# EAGLE design LoL_Shield (EAGLE 5.06)
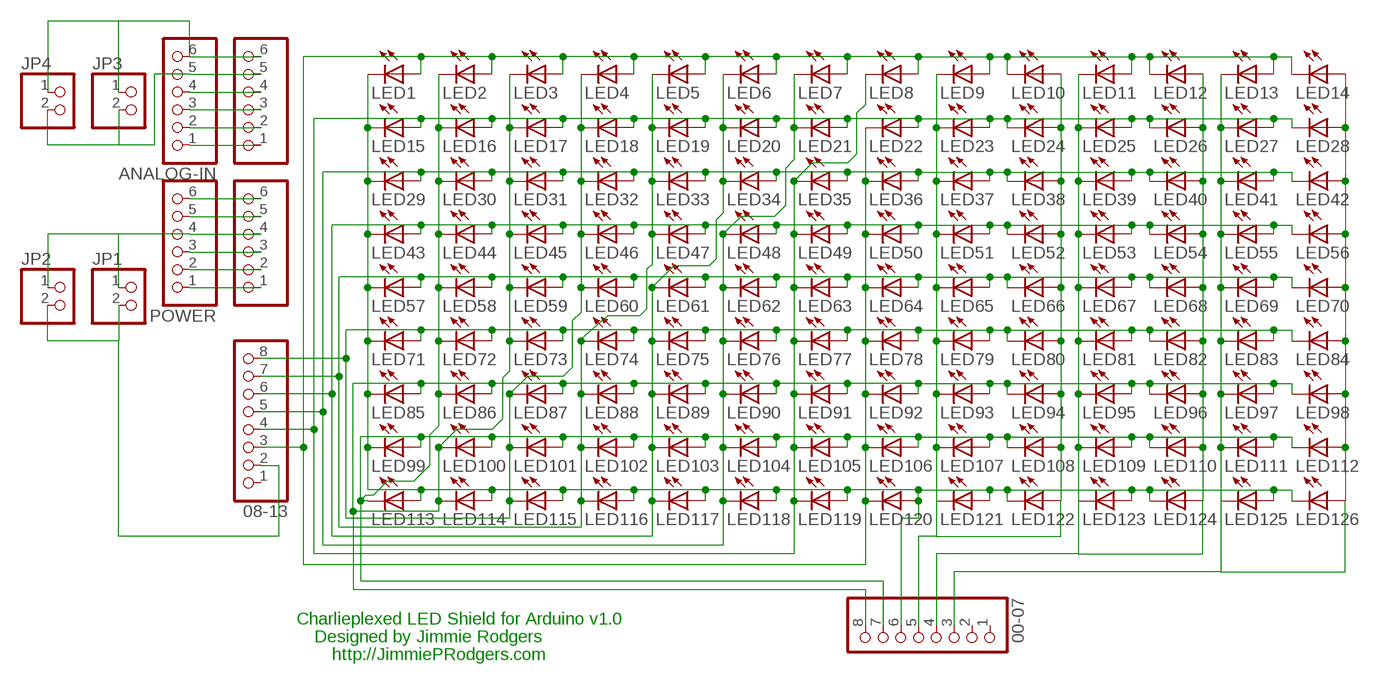
[diagram p0: schematic, sheet 1]

## Parts
00-07  PINHD-1X8CLEANBIG  [1X08-CLEANBIG]
08-13  PINHD-1X8CLEANBIG  [1X08-CLEANBIG]
ANALOG-IN  PINHD-1X6CB  [1X06-CLEANBIG]
ANALOG-IN1  PINHD-1X6CB  [1X06-CLEANBIG]
JP1  PINHD-1X2  [1X02]
JP2  PINHD-1X2  [1X02]
JP3  PINHD-1X2  [1X02]
JP4  PINHD-1X2  [1X02]
LED1  LED3MM  [LED3MM]
LED2  LED3MM  [LED3MM]
LED3  LED3MM  [LED3MM]
LED4  LED3MM  [LED3MM]
LED5  LED3MM  [LED3MM]
LED6  LED3MM  [LED3MM]
LED7  LED3MM  [LED3MM]
LED8  LED3MM  [LED3MM]
LED9  LED3MM  [LED3MM]
LED10  LED3MM  [LED3MM]
LED11  LED3MM  [LED3MM]
LED12  LED3MM  [LED3MM]
LED13  LED3MM  [LED3MM]
LED14  LED3MM  [LED3MM]
LED15  LED3MM  [LED3MM]
LED16  LED3MM  [LED3MM]
LED17  LED3MM  [LED3MM]
LED18  LED3MM  [LED3MM]
LED19  LED3MM  [LED3MM]
LED20  LED3MM  [LED3MM]
LED21  LED3MM  [LED3MM]
LED22  LED3MM  [LED3MM]
LED23  LED3MM  [LED3MM]
LED24  LED3MM  [LED3MM]
LED25  LED3MM  [LED3MM]
LED26  LED3MM  [LED3MM]
LED27  LED3MM  [LED3MM]
LED28  LED3MM  [LED3MM]
LED29  LED3MM  [LED3MM]
LED30  LED3MM  [LED3MM]
LED31  LED3MM  [LED3MM]
LED32  LED3MM  [LED3MM]
LED33  LED3MM  [LED3MM]
LED34  LED3MM  [LED3MM]
LED35  LED3MM  [LED3MM]
LED36  LED3MM  [LED3MM]
LED37  LED3MM  [LED3MM]
LED38  LED3MM  [LED3MM]
LED39  LED3MM  [LED3MM]
LED40  LED3MM  [LED3MM]
LED41  LED3MM  [LED3MM]
LED42  LED3MM  [LED3MM]
LED43  LED3MM  [LED3MM]
LED44  LED3MM  [LED3MM]
LED45  LED3MM  [LED3MM]
LED46  LED3MM  [LED3MM]
LED47  LED3MM  [LED3MM]
LED48  LED3MM  [LED3MM]
LED49  LED3MM  [LED3MM]
LED50  LED3MM  [LED3MM]
LED51  LED3MM  [LED3MM]
LED52  LED3MM  [LED3MM]
LED53  LED3MM  [LED3MM]
LED54  LED3MM  [LED3MM]
LED55  LED3MM  [LED3MM]
LED56  LED3MM  [LED3MM]
LED57  LED3MM  [LED3MM]
LED58  LED3MM  [LED3MM]
LED59  LED3MM  [LED3MM]
LED60  LED3MM  [LED3MM]
LED61  LED3MM  [LED3MM]
LED62  LED3MM  [LED3MM]
LED63  LED3MM  [LED3MM]
LED64  LED3MM  [LED3MM]
LED65  LED3MM  [LED3MM]
LED66  LED3MM  [LED3MM]
LED67  LED3MM  [LED3MM]
LED68  LED3MM  [LED3MM]
LED69  LED3MM  [LED3MM]
LED70  LED3MM  [LED3MM]
LED71  LED3MM  [LED3MM]
LED72  LED3MM  [LED3MM]
LED73  LED3MM  [LED3MM]
LED74  LED3MM  [LED3MM]
LED75  LED3MM  [LED3MM]
LED76  LED3MM  [LED3MM]
LED77  LED3MM  [LED3MM]
LED78  LED3MM  [LED3MM]
LED79  LED3MM  [LED3MM]
LED80  LED3MM  [LED3MM]
LED81  LED3MM  [LED3MM]
LED82  LED3MM  [LED3MM]
LED83  LED3MM  [LED3MM]
LED84  LED3MM  [LED3MM]
LED85  LED3MM  [LED3MM]
LED86  LED3MM  [LED3MM]
LED87  LED3MM  [LED3MM]
LED88  LED3MM  [LED3MM]
LED89  LED3MM  [LED3MM]
LED90  LED3MM  [LED3MM]
LED91  LED3MM  [LED3MM]
LED92  LED3MM  [LED3MM]
LED93  LED3MM  [LED3MM]
LED94  LED3MM  [LED3MM]
LED95  LED3MM  [LED3MM]
LED96  LED3MM  [LED3MM]
LED97  LED3MM  [LED3MM]
LED98  LED3MM  [LED3MM]
LED99  LED3MM  [LED3MM]
LED100  LED3MM  [LED3MM]
LED101  LED3MM  [LED3MM]
LED102  LED3MM  [LED3MM]
LED103  LED3MM  [LED3MM]
LED104  LED3MM  [LED3MM]
LED105  LED3MM  [LED3MM]
LED106  LED3MM  [LED3MM]
LED107  LED3MM  [LED3MM]
LED108  LED3MM  [LED3MM]
LED109  LED3MM  [LED3MM]
LED110  LED3MM  [LED3MM]
LED111  LED3MM  [LED3MM]
LED112  LED3MM  [LED3MM]
LED113  LED3MM  [LED3MM]
LED114  LED3MM  [LED3MM]
LED115  LED3MM  [LED3MM]
LED116  LED3MM  [LED3MM]
LED117  LED3MM  [LED3MM]
LED118  LED3MM  [LED3MM]
LED119  LED3MM  [LED3MM]
LED120  LED3MM  [LED3MM]
LED121  LED3MM  [LED3MM]
LED122  LED3MM  [LED3MM]
LED123  LED3MM  [LED3MM]
LED124  LED3MM  [LED3MM]
LED125  LED3MM  [LED3MM]
LED126  LED3MM  [LED3MM]
POWER  PINHD-1X6CB  [1X06-CLEANBIG]
POWER1  PINHD-1X6CB  [1X06-CLEANBIG]

## Nets
N$1: 08-13.2 JP1.2 JP2.2
N$2: ANALOG-IN1.5 ANALOG-IN.5 JP3.2 JP4.2
N$5: 00-07.5 LED9.K(C) LED10.A LED23.K(C) LED24.A LED37.K(C) LED38.A LED51.K(C) LED52.A LED65.K(C) LED66.A LED79.K(C) LED80.A LED93.K(C) LED94.A LED107.K(C) LED108.A LED121.K(C) LED122.A
N$11: ANALOG-IN1.6 ANALOG-IN.6 JP3.1 JP4.1
N$12: JP1.1 JP2.1 POWER1.4 POWER.4
N$39: ANALOG-IN1.4 ANALOG-IN.4
N$40: ANALOG-IN1.3 ANALOG-IN.3
N$41: ANALOG-IN1.2 ANALOG-IN.2
N$42: ANALOG-IN1.1 ANALOG-IN.1
N$43: POWER1.6 POWER.6
N$44: POWER1.5 POWER.5
N$46: POWER1.3 POWER.3
N$47: POWER1.2 POWER.2
N$48: POWER1.1 POWER.1
PIN2: 00-07.3 LED13.K(C) LED14.A LED27.K(C) LED28.A LED41.K(C) LED42.A LED55.K(C) LED56.A LED69.K(C) LED70.A LED83.K(C) LED84.A LED97.K(C) LED98.A LED111.K(C) LED112.A LED125.K(C) LED126.A
PIN3: 00-07.4 LED11.K(C) LED12.A LED25.K(C) LED26.A LED39.K(C) LED40.A LED53.K(C) LED54.A LED67.K(C) LED68.A LED81.K(C) LED82.A LED95.K(C) LED96.A LED109.K(C) LED110.A LED123.K(C) LED124.A
PIN5: 00-07.6 LED1.K(C) LED15.K(C) LED29.K(C) LED43.K(C) LED57.K(C) LED71.K(C) LED85.K(C) LED99.K(C) LED113.A LED114.A LED115.A LED116.A LED117.A LED118.A LED119.A LED120.A LED121.A LED122.K(C) LED123.A LED124.K(C) LED125.A LED126.K(C)
PIN6: 00-07.7 LED2.K(C) LED16.K(C) LED30.K(C) LED44.K(C) LED58.K(C) LED72.K(C) LED86.K(C) LED99.A LED100.A LED101.A LED102.A LED103.A LED104.A LED105.A LED106.A LED107.A LED108.K(C) LED109.A LED110.K(C) LED111.A LED112.K(C) LED113.K(C)
PIN7: 00-07.8 LED3.K(C) LED17.K(C) LED31.K(C) LED45.K(C) LED59.K(C) LED73.K(C) LED85.A LED86.A LED87.A LED88.A LED89.A LED90.A LED91.A LED92.A LED93.A LED94.K(C) LED95.A LED96.K(C) LED97.A LED98.K(C) LED100.K(C) LED114.K(C)
PIN8: 08-13.8 LED4.K(C) LED18.K(C) LED32.K(C) LED46.K(C) LED60.K(C) LED71.A LED72.A LED73.A LED74.A LED75.A LED76.A LED77.A LED78.A LED79.A LED80.K(C) LED81.A LED82.K(C) LED83.A LED84.K(C) LED87.K(C) LED101.K(C) LED115.K(C)
PIN9: 08-13.7 LED5.K(C) LED19.K(C) LED33.K(C) LED47.K(C) LED57.A LED58.A LED59.A LED60.A LED61.A LED62.A LED63.A LED64.A LED65.A LED66.K(C) LED67.A LED68.K(C) LED69.A LED70.K(C) LED74.K(C) LED88.K(C) LED102.K(C) LED116.K(C)
PIN10: 08-13.6 LED6.K(C) LED20.K(C) LED34.K(C) LED43.A LED44.A LED45.A LED46.A LED47.A LED48.A LED49.A LED50.A LED51.A LED52.K(C) LED53.A LED54.K(C) LED55.A LED56.K(C) LED61.K(C) LED75.K(C) LED89.K(C) LED103.K(C) LED117.K(C)
PIN11: 08-13.5 LED7.K(C) LED21.K(C) LED29.A LED30.A LED31.A LED32.A LED33.A LED34.A LED35.A LED36.A LED37.A LED38.K(C) LED39.A LED40.K(C) LED41.A LED42.K(C) LED48.K(C) LED62.K(C) LED76.K(C) LED90.K(C) LED104.K(C) LED118.K(C)
PIN12: 08-13.4 LED8.K(C) LED15.A LED16.A LED17.A LED18.A LED19.A LED20.A LED21.A LED22.A LED23.A LED24.K(C) LED25.A LED26.K(C) LED27.A LED28.K(C) LED35.K(C) LED49.K(C) LED63.K(C) LED77.K(C) LED91.K(C) LED105.K(C) LED119.K(C)
PIN13: 08-13.3 LED1.A LED2.A LED3.A LED4.A LED5.A LED6.A LED7.A LED8.A LED9.A LED10.K(C) LED11.A LED12.K(C) LED13.A LED14.K(C) LED22.K(C) LED36.K(C) LED50.K(C) LED64.K(C) LED78.K(C) LED92.K(C) LED106.K(C) LED120.K(C)
Unconnected: 00-07.1 00-07.2 08-13.1

## Notes on the sheet
- Charlieplexed LED Shield for Arduino v1.0
- Designed by Jimmie Rodgers
- http://JimmiePRodgers.com

## Library data of the parts
00-07 08-13 = carduino:PINHD-1X8: PIN HEADER
ANALOG-IN ANALOG-IN1 POWER POWER1 = carduino:PINHD-1X6: PIN HEADER
JP1 JP2 JP4 = pinhead:PINHD-1X2: PIN HEADER
JP3 = custom-jpr:PINHD-1X2: PIN HEADER
LED1-LED126 = led:LED: LED OSRAM: - CHIPLED LG R971, LG N971, LY N971, LG Q971, LY Q971, LO R971, LY R971 LH N974, LH R974 LS Q976, LO Q976, LY Q976 LO Q996 - Hyper CHIPLED LW Q18S LB Q993, LB Q99A, LB R99A - SideLED LS A670, LO A670, LY A670, LG A670, LP A670 LB A673, LV A673, LT A673, LW A673 LH A674 LY A675 LS A676, LA A676, LO A676, LY A676, LW A676 LS A679, LY A679, LG A679 - Hyper Micro SIDELED® LS Y876, LA Y876, LO Y876, LY Y876 LT Y87S - SmartLED LW L88C, LW L88S LB L89C, LB L89S, LG L890 LS L89K, LO L89K, LY L89K LS L896, LA L896, LO L896, LY L896 - TOPLED LS T670, LO T670, LY T670, LG T670, LP T670 LSG T670, LSP T670, LSY T670, LOP T670, LYG T670 LG T671, LOG T671, LSG T671 LB T673, LV T673, LT T673, LW T673 LH T674 LS T676, LA T676, LO T676, LY T676, LB T676, LH T676, LSB T676, LW T676 LB T67C, LV T67C, LT T67C, LS T67K, LO T67K, LY T67K, LW E67C LS E67B, LA E67B, LO E67B, LY E67B, LB E67C, LV E67C, LT E67C LW T67C LS T679, LY T679, LG T679 LS T770, LO T770, LY T770, LG T770, LP T770 LB T773, LV T773, LT T773, LW T773 LH T774 LS E675, LA E675, LY E675, LS T675 LS T776, LA T776, LO T776, LY T776, LB T776 LHGB T686 LT T68C, LB T68C - Hyper Mini TOPLED® LB M676 - Mini TOPLED Santana® LG M470 LS M47K, LO M47K, LY M47K Source: http://www.osram.convergy.de LUXEON: - LUMILED® LXK2-PW12-R00, LXK2-PW12-S00, LXK2-PW14-U00, LXK2-PW14-V00 LXK2-PM12-R00, LXK2-PM12-S00, LXK2-PM14-U00 LXK2-PE12-Q00, LXK2-PE12-R00, LXK2-PE12-S00, LXK2-PE14-T00, LXK2-PE14-U00 LXK2-PB12-K00, LXK2-PB12-L00, LXK2-PB12-M00, LXK2-PB14-N00, LXK2-PB14-P00, LXK2-PB14-Q00 LXK2-PR12-L00, LXK2-PR12-M00, LXK2-PR14-Q00, LXK2-PR14-R00 LXK2-PD12-Q00, LXK2-PD12-R00, LXK2-PD12-S00 LXK2-PH12-R00, LXK2-PH12-S00 LXK2-PL12-P00, LXK2-PL12-Q00, LXK2-PL12-R00 Source: www.luxeon.com KINGBRIGHT: KA-3528ASYC Source: www.kingbright.com

## Board
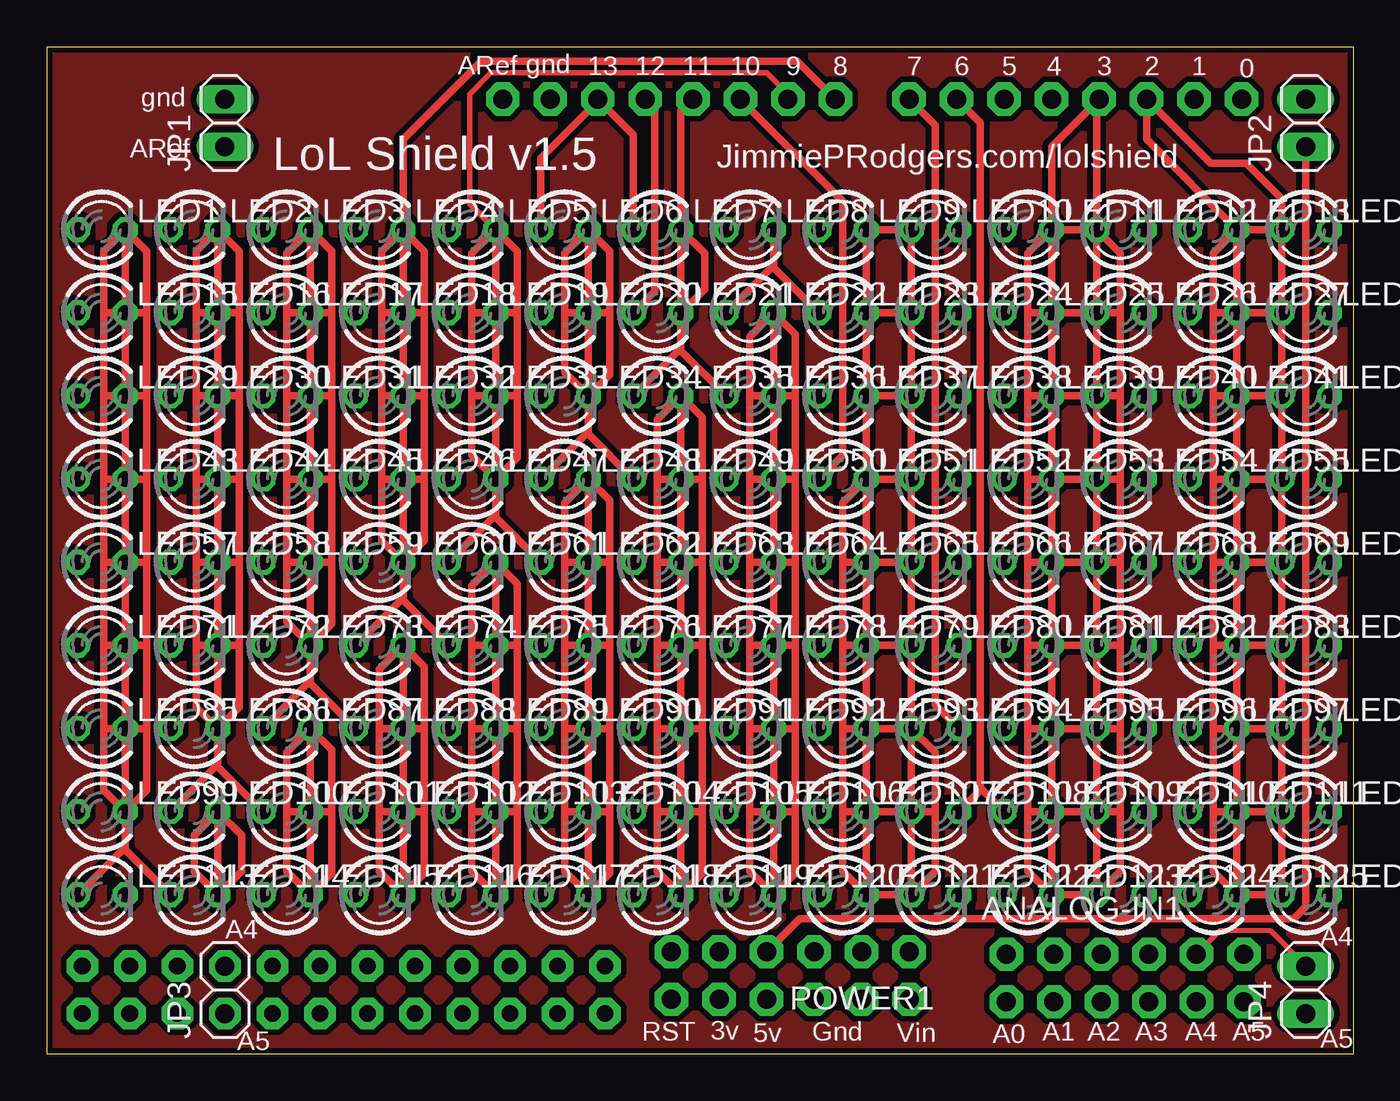
[diagram p1: board, top side]
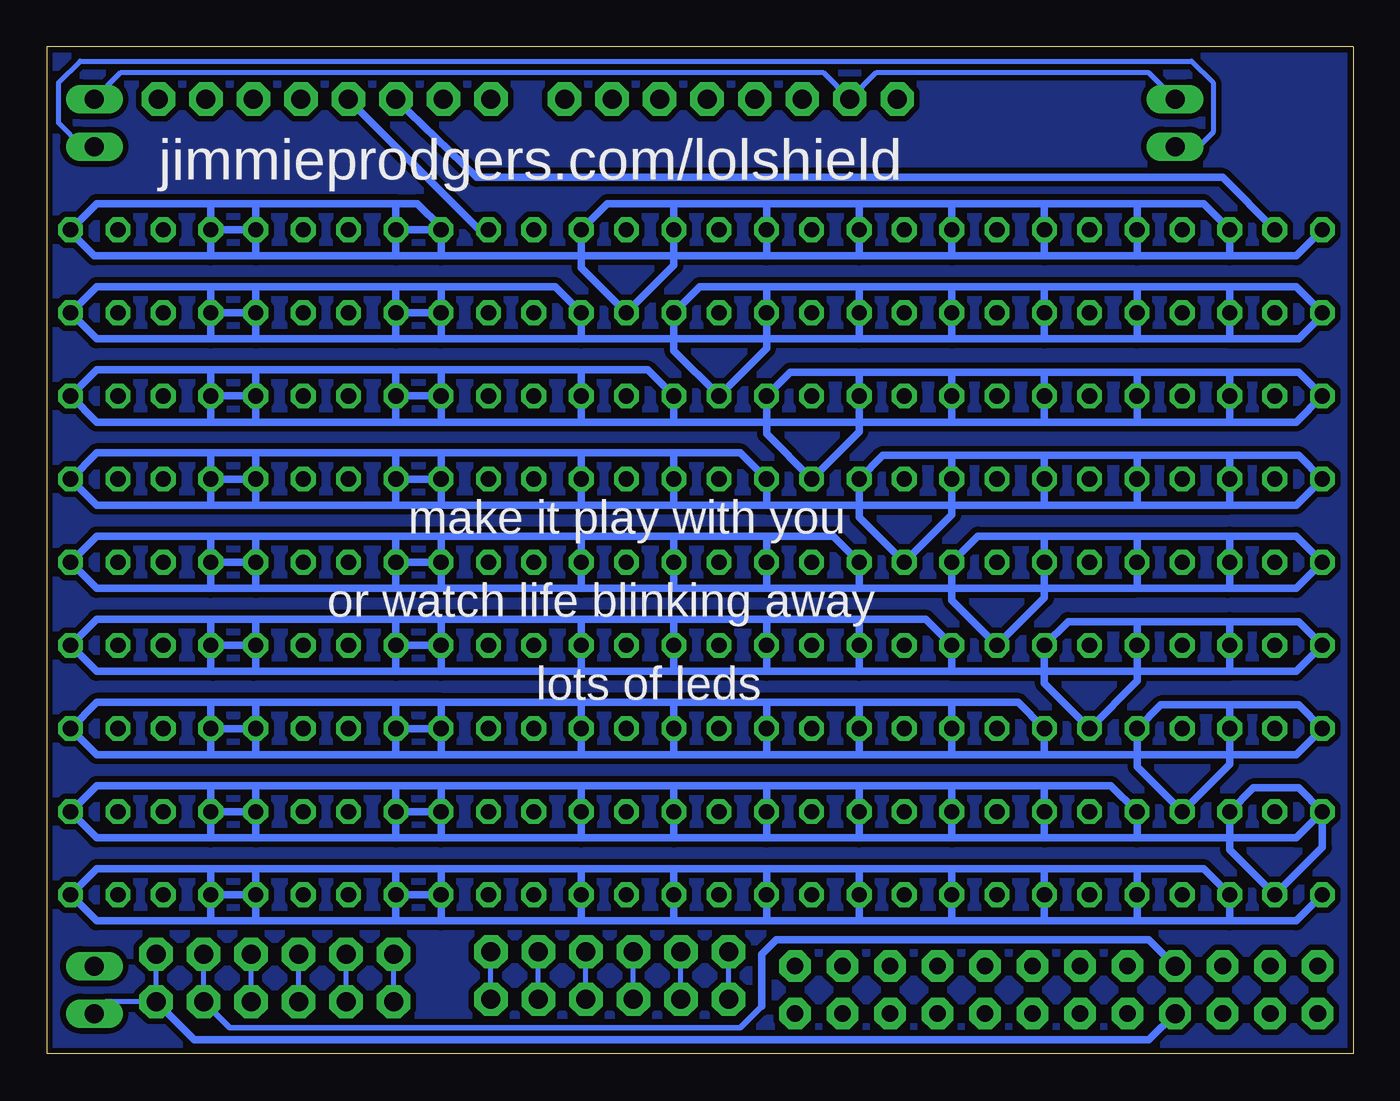
[diagram p2: board, bottom side, seen from below]

Size 69.85 x 53.85 mm. Coordinates in mm from the lower left corner, seen from the top.
Outline: 0,0 69.85,0 69.85,53.85 0,53.85 0,0
Copper layers (1*16): Top 0.035mm / dielectric 1.5mm / Bottom 0.035mm
Design rules "default": minimum track width 10mil, minimum drill 19mil, track to track 10mil, track to pad 10mil, pad to pad 0mil, via to via 10mil, smd to smd 0mil, copper to edge 10mil, drill to drill 8mil, minimum pad ring 10mil, minimum via ring 8mil, stop-mask expansion 4mil, vias tented up to drill 0mil, thermal gap 10mil

### Footprints (pad centres in the part's own frame; a part is rotated, then mirrored left to right if it is on the bottom)
1X08-CLEANBIG = drill 1.016 pad 1.778 octagon: 1 -8.89,0; 2 -6.35,0; 3 -3.81,0; 4 -1.27,0; 5 1.27,0; 6 3.81,0; 7 6.35,0; 8 8.89,0
1X06-CLEANBIG = drill 1.016 pad 1.778 octagon: 1 -6.35,0; 2 -3.81,0; 3 -1.27,0; 4 1.27,0; 5 3.81,0; 6 6.35,0
1X02 = drill 1.016 long: 1 -1.27,0; 2 1.27,0
1X02' = drill 1.016 pad 1.676 octagon: 1 -1.27,0; 2 1.27,0
LED3MM = drill 0.813 octagon: A -1.27,0; K 1.27,0

### Placement (x,y rotation side)
00-07  54.99,51.05 180 top
08-13  33.27,51.05 0 top
ANALOG-IN  57.66,2.79 0 top
ANALOG-IN1  57.66,5.33 0 top
JP1  9.53,49.78 90 top
JP2  67.31,49.78 90 top
JP3  [1X02']  9.53,3.43 90 top
JP4  67.31,3.43 90 top
LED1  2.92,44.07 0 top
LED2  7.87,44.07 0 top
LED3  12.83,44.07 0 top
LED4  17.78,44.07 0 top
LED5  22.73,44.07 0 top
LED6  27.69,44.07 0 top
LED7  32.64,44.07 0 top
LED8  37.59,44.07 0 top
LED9  42.55,44.07 0 top
LED10  47.5,44.07 0 top
LED11  52.45,44.07 0 top
LED12  57.4,44.07 0 top
LED13  62.36,44.07 0 top
LED14  67.31,44.07 0 top
LED15  2.92,39.62 0 top
LED16  7.87,39.62 0 top
LED17  12.83,39.62 0 top
LED18  17.78,39.62 0 top
LED19  22.73,39.62 0 top
LED20  27.69,39.62 0 top
LED21  32.64,39.62 0 top
LED22  37.59,39.62 0 top
LED23  42.55,39.62 0 top
LED24  47.5,39.62 0 top
LED25  52.45,39.62 0 top
LED26  57.4,39.62 0 top
LED27  62.36,39.62 0 top
LED28  67.31,39.62 0 top
LED29  2.92,35.18 0 top
LED30  7.87,35.18 0 top
LED31  12.83,35.18 0 top
LED32  17.78,35.18 0 top
LED33  22.73,35.18 0 top
LED34  27.69,35.18 0 top
LED35  32.64,35.18 0 top
LED36  37.59,35.18 0 top
LED37  42.55,35.18 0 top
LED38  47.5,35.18 0 top
LED39  52.45,35.18 0 top
LED40  57.4,35.18 0 top
LED41  62.36,35.18 0 top
LED42  67.31,35.18 0 top
LED43  2.92,30.73 0 top
LED44  7.87,30.73 0 top
LED45  12.83,30.73 0 top
LED46  17.78,30.73 0 top
LED47  22.73,30.73 0 top
LED48  27.69,30.73 0 top
LED49  32.64,30.73 0 top
LED50  37.59,30.73 0 top
LED51  42.55,30.73 0 top
LED52  47.5,30.73 0 top
LED53  52.45,30.73 0 top
LED54  57.4,30.73 0 top
LED55  62.36,30.73 0 top
LED56  67.31,30.73 0 top
LED57  2.92,26.29 0 top
LED58  7.87,26.29 0 top
LED59  12.83,26.29 0 top
LED60  17.78,26.29 0 top
LED61  22.73,26.29 0 top
LED62  27.69,26.29 0 top
LED63  32.64,26.29 0 top
LED64  37.59,26.29 0 top
LED65  42.55,26.29 0 top
LED66  47.5,26.29 0 top
LED67  52.45,26.29 0 top
LED68  57.4,26.29 0 top
LED69  62.36,26.29 0 top
LED70  67.31,26.29 0 top
LED71  2.92,21.84 0 top
LED72  7.87,21.84 0 top
LED73  12.83,21.84 0 top
LED74  17.78,21.84 0 top
LED75  22.73,21.84 0 top
LED76  27.69,21.84 0 top
LED77  32.64,21.84 0 top
LED78  37.59,21.84 0 top
LED79  42.55,21.84 0 top
LED80  47.5,21.84 0 top
LED81  52.45,21.84 0 top
LED82  57.4,21.84 0 top
LED83  62.36,21.84 0 top
LED84  67.31,21.84 0 top
LED85  2.92,17.4 0 top
LED86  7.87,17.4 0 top
LED87  12.83,17.4 0 top
LED88  17.78,17.4 0 top
LED89  22.73,17.4 0 top
LED90  27.69,17.4 0 top
LED91  32.64,17.4 0 top
LED92  37.59,17.4 0 top
LED93  42.55,17.4 0 top
LED94  47.5,17.4 0 top
LED95  52.45,17.4 0 top
LED96  57.4,17.4 0 top
LED97  62.36,17.4 0 top
LED98  67.31,17.4 0 top
LED99  2.92,12.95 0 top
LED100  7.87,12.95 0 top
LED101  12.83,12.95 0 top
LED102  17.78,12.95 0 top
LED103  22.73,12.95 0 top
LED104  27.69,12.95 0 top
LED105  32.64,12.95 0 top
LED106  37.59,12.95 0 top
LED107  42.55,12.95 0 top
LED108  47.5,12.95 0 top
LED109  52.45,12.95 0 top
LED110  57.4,12.95 0 top
LED111  62.36,12.95 0 top
LED112  67.31,12.95 0 top
LED113  2.92,8.51 0 top
LED114  7.87,8.51 0 top
LED115  12.83,8.51 0 top
LED116  17.78,8.51 0 top
LED117  22.73,8.51 0 top
LED118  27.69,8.51 0 top
LED119  32.64,8.51 0 top
LED120  37.59,8.51 0 top
LED121  42.55,8.51 0 top
LED122  47.5,8.51 0 top
LED123  52.45,8.51 0 top
LED124  57.4,8.51 0 top
LED125  62.36,8.51 0 top
LED126  67.31,8.51 0 top
POWER  39.75,2.92 180 top
POWER1  39.75,5.46 180 top

### Tracks (layer width: path | path; a pad name or v marks a point on that pad's centre or on a via)
BOTTOMFILL
  pour Bottom (isolate 0.305): 0,53.85 69.85,53.85 69.85,0 0,0
N$1
  Bottom 0.254: JP1.2 10.92,52.45 25.53,52.45 08-13.2 28.32,52.45 65.91,52.45 JP2.2
N$2
  Top 0.254: ANALOG-IN1.5 62.74,6.6 65.41,6.6 JP4.2
  Bottom 0.254: ANALOG-IN.5 ANALOG-IN1.5
  Bottom 0.305: ANALOG-IN.5 60.07,1.4 32.77,1.4 31.62,2.54
  Bottom 0.406: JP3.2 10.92,6.1 30.86,6.1 31.62,5.33 31.62,2.54
N$3  (via drill 0.9 pad 1.68)
  other vias: 6.99,4.7
N$5
  Top 0.406: 43.94,8.38 42.55,9.78 42.55,12.95 | LED107.K LED121.K LED122.A | LED107.K LED93.K | LED93.K LED79.K | LED65.K LED79.K | LED65.K LED51.K | LED51.K LED37.K | LED37.K LED23.K | LED23.K LED9.K LED10.A LED24.A | LED107.K LED108.A | LED93.K LED94.A | LED79.K LED80.A | LED65.K LED66.A | LED51.K LED52.A | LED37.K LED38.A | LED23.K LED24.A | LED38.A LED24.A | LED52.A LED38.A | LED94.A LED80.A | LED66.A LED80.A | LED66.A LED52.A | LED108.A LED122.A | LED108.A LED94.A | LED122.A 47.5,9.78 47.5,12.95 | 47.5,12.95 47.5,16.13 LED94.A | LED108.A 47.5,12.95 | 42.55,12.95 42.55,26.29 | 42.55,26.29 42.55,29.46 LED51.K | 42.55,26.29 LED65.K | LED79.K 42.67,21.84 | LED93.K 42.67,17.4 | 42.55,12.95 LED107.K
  Bottom 0.406: LED10.A 46.74,44.07 00-07.5
N$7  (via drill 0.9 pad 1.68)
  other vias: 12.06,4.7
N$8  (via drill 0.9 pad 1.68)
  other vias: 14.61,4.7
N$9  (via drill 0.9 pad 1.68)
  other vias: 17.14,4.7
N$10  (via drill 0.9 pad 1.68)
  other vias: 19.68,4.7
N$11
  Bottom 0.254: ANALOG-IN1.6 ANALOG-IN.6 66.67,2.79 JP4.1
  Bottom 0.406: JP3.1 10.92,0.76 61.98,0.76 ANALOG-IN.6
N$12
  Top 0.406: POWER1.4 40.26,7.24 66.67,7.24 67.31,7.87 JP2.1
  Bottom 0.254: POWER.4 POWER1.4 | JP1.1 8.26,48.51 7.49,49.28 7.49,51.94 8.64,53.09 68.07,53.09 69.22,51.94 69.22,49.78 67.94,48.51 JP2.1
N$13  (via drill 0.9 pad 1.68)
  other vias: 6.99,2.16
N$15  (via drill 0.9 pad 1.68)
  other vias: 12.06,2.16
N$18  (via drill 0.9 pad 1.68)
  other vias: 14.61,2.16
N$27  (via drill 0.9 pad 1.68)
  other vias: 17.14,2.16
N$28  (via drill 0.9 pad 1.68)
  other vias: 19.68,2.16
N$29  (via drill 0.9 pad 1.68)
  other vias: 22.23,4.7
N$30  (via drill 0.9 pad 1.68)
  other vias: 22.23,2.16
N$31  (via drill 0.9 pad 1.68)
  other vias: 24.77,4.7
N$32  (via drill 0.9 pad 1.68)
  other vias: 24.77,2.16
N$33  (via drill 0.9 pad 1.68)
  other vias: 29.84,4.7
N$34  (via drill 0.9 pad 1.68)
  other vias: 27.3,2.16
N$35  (via drill 0.9 pad 1.68)
  other vias: 29.84,2.16
N$36  (via drill 0.9 pad 1.68)
  other vias: 27.3,4.7
N$37  (via drill 0.9 pad 1.68)
  other vias: 1.91,4.7
N$38  (via drill 0.9 pad 1.68)
  other vias: 1.91,2.16
N$39
  Bottom 0.254: ANALOG-IN.4 ANALOG-IN1.4
N$40
  Bottom 0.254: ANALOG-IN.3 ANALOG-IN1.3
N$41
  Bottom 0.254: ANALOG-IN.2 ANALOG-IN1.2
N$42
  Bottom 0.254: ANALOG-IN.1 ANALOG-IN1.1
N$43
  Bottom 0.254: POWER.6 POWER1.6
N$44
  Bottom 0.254: POWER.5 POWER1.5
N$45  (via drill 0.9 pad 1.68)
  other vias: 4.45,4.7
N$46
  Bottom 0.254: POWER.3 POWER1.3
N$47
  Bottom 0.254: POWER.2 POWER1.2
N$48
  Bottom 0.254: POWER.1 POWER1.1
N$49  (via drill 0.9 pad 1.68)
  other vias: 4.45,2.16
PIN2
  Top 0.406: LED28.A LED14.A | LED125.K LED126.A | LED111.K LED112.A 66.04,13.08 | LED97.K LED98.A | LED83.K LED84.A | LED69.K LED70.A | LED55.K LED56.A | LED41.K LED42.A | LED27.K LED28.A | LED125.K LED126.A | LED125.K LED111.K | LED111.K LED97.K | LED97.K LED83.K | LED83.K LED69.K | LED69.K LED55.K | LED55.K LED41.K | LED41.K LED27.K | LED42.A LED28.A | LED56.A LED42.A | LED70.A LED56.A | LED84.A LED70.A | LED98.A LED84.A | 66.04,13.08 LED98.A | LED126.A 66.04,13.08 | LED13.K 58.8,48.89 00-07.3 62.23,47.62 64.14,47.62 66.04,45.72 LED14.A | LED13.K LED14.A | LED27.K LED13.K | LED13.K 62.36,42.8 62.36,39.62 | 62.36,35.18 62.36,39.62 | 62.36,30.73 62.36,35.18 | 62.36,26.29 62.36,30.73 | 62.36,21.84 62.36,26.29 | 62.36,17.4 62.36,21.84 | 62.36,12.95 62.36,17.4 | 62.36,12.95 62.36,9.78 LED125.K | 62.36,39.62 LED27.K | 62.36,35.18 LED41.K | 62.36,30.73 LED55.K | 62.36,26.29 LED69.K | 62.36,21.84 LED83.K | 62.36,17.4 LED97.K | 62.36,12.95 LED111.K
PIN3
  Top 0.406: LED123.K LED109.K | LED109.K LED95.K | LED95.K LED81.K | LED81.K LED67.K | LED67.K LED53.K | LED39.K LED53.K | LED39.K LED25.K | LED25.K LED11.K | LED11.K LED12.A | LED25.K LED26.A | LED39.K LED40.A | LED53.K LED54.A | LED67.K LED68.A | LED81.K LED82.A | LED95.K LED96.A | LED109.K LED110.A | LED123.K LED124.A | LED124.A LED110.A | LED110.A LED96.A | LED96.A LED82.A | LED82.A LED68.A | LED68.A LED54.A | LED40.A LED54.A | LED40.A LED26.A | LED26.A LED12.A | LED12.A 56.13,50.93 00-07.4 53.72,48.51 LED11.K | LED12.A 57.4,42.8 57.4,39.62 | 57.4,35.18 57.4,39.62 | 57.4,26.29 57.4,35.18 | 57.4,12.95 57.4,26.29 | 57.4,12.95 57.4,9.78 LED124.A | LED123.K 52.45,9.78 52.45,12.95 | 52.45,12.95 52.45,17.4 | 52.45,17.4 52.45,21.84 | 52.45,21.84 52.45,35.18 | 52.45,35.18 52.45,39.62 | 52.45,39.62 52.45,42.8 LED11.K | 52.45,39.62 LED25.K | 57.4,39.62 LED26.A | LED40.A 57.4,35.18 | 52.45,35.18 LED39.K | LED54.A 57.28,30.73 | LED53.K 52.58,30.73 | LED67.K 52.58,26.29 | 57.4,26.29 LED68.A | LED82.A 57.28,21.84 | 52.45,21.84 LED81.K | 52.45,17.4 LED95.K | LED96.A 57.28,17.4 | 52.45,12.95 LED109.K | LED110.A 57.4,12.95
PIN5
  Top 0.406: LED1.K 3.05,42.93 3.05,39.37 | 3.05,17.27 3.05,14.1 LED99.K | 3.05,17.27 3.05,21.84 | 3.05,21.84 3.05,26.29 | 3.05,26.29 3.05,30.61 | 3.05,35.18 3.05,30.61 | 3.05,39.37 3.05,35.18 | LED1.K 5.33,42.93 5.33,35.18 | 5.33,35.18 5.33,30.73 | 5.33,30.73 5.33,26.29 | 5.33,21.84 5.33,26.29 | 5.33,17.4 5.33,21.84 | 3.05,17.27 3.05,17.4 LED85.K 5.33,17.4 | 3.05,21.84 LED71.K 5.33,21.84 | 3.05,26.29 LED57.K 5.33,26.29 | 3.05,30.61 3.05,30.73 LED43.K 5.33,30.73 | 3.05,35.18 3.05,35.31 | 3.05,39.37 3.05,39.62 LED15.K 5.33,39.62 | 3.05,35.18 LED29.K 5.33,35.18 | LED114.A 4.19,10.92 LED99.K | 5.33,17.4 5.33,14.1 LED99.K | LED99.K LED1.K | LED113.A 4.06,10.92
  Bottom 0.406: 6.6,7.11 3.05,7.11 LED113.A | 6.6,7.11 11.56,7.11 | 11.56,7.11 16.51,7.11 | 16.51,7.11 21.46,7.11 | 21.46,7.11 26.42,7.11 | 26.42,7.11 31.24,7.11 | 31.24,7.11 36.32,7.11 | 36.32,7.11 41.27,7.11 | 41.27,7.11 48.77,7.11 | 48.77,7.11 51.18,7.11 | 51.18,7.11 58.67,7.11 | 58.67,7.11 61.09,7.11 | 61.09,7.11 67.18,7.11 LED126.K 67.18,9.91 61.09,9.91 | 51.18,9.91 58.67,9.91 | 58.67,9.91 61.09,9.91 | 26.42,9.91 31.37,9.91 | 31.37,9.91 36.32,9.91 | 36.32,9.91 41.27,9.91 | 41.27,9.91 48.77,9.91 | 48.77,9.91 51.18,9.91 | 21.46,9.91 26.42,9.91 | 11.56,9.91 8,9.91 LED114.A 6.6,7.11 | 11.56,9.91 16.51,9.91 | 16.51,9.91 21.46,9.91 | 41.27,7.11 LED121.A 41.27,9.91 | LED122.K LED123.A | 48.77,7.11 LED122.K | 58.67,7.11 LED124.K | LED124.K LED125.A | 11.56,7.11 LED115.A 11.56,9.91 | 16.51,7.11 LED116.A 16.51,9.91 | 21.46,7.11 LED117.A 21.46,9.91 | 26.42,7.11 LED118.A 26.42,9.91 | 31.24,7.11 31.37,7.24 LED119.A 31.37,9.91 | 36.32,7.11 LED120.A 36.32,9.91 | LED122.K 48.77,9.91 | 51.18,7.11 51.18,9.91 | 58.67,9.91 LED124.K | 61.09,7.11 61.09,9.91 | 00-07.6 46.86,46.86 6.99,46.86 LED1.K
PIN6
  Top 0.406: LED2.K 8,42.93 8,39.75 | 8,21.72 8,18.54 LED86.K | 8,21.72 8,26.29 | 8,26.29 8,30.73 | 8,35.18 8,30.73 | 8,39.75 8,35.18 | 8,39.75 8,39.62 LED16.K 10.29,39.62 | 8,35.18 LED30.K 10.29,35.18 | 8,30.73 LED44.K 10.29,30.73 | 8,26.29 LED58.K 10.29,26.29 | 8,21.72 8,21.84 LED72.K 10.29,21.84 | LED86.K 10.29,18.54 10.29,21.84 | 10.29,21.84 10.29,26.29 | 10.29,26.29 10.29,30.73 | 10.29,35.18 10.29,30.73 | 10.29,39.62 10.29,35.18 | 10.29,39.62 10.29,42.93 LED2.K | LED86.K LED2.K | 9.14,15.49 9.14,15.37 LED101.A | 9.14,15.49 LED86.K | LED100.A 9.14,15.49 | 00-07.7 49.91,49.78 49.91,15.24 | 49.91,15.24 49.91,14.1 LED108.K | 49.91,15.24 49.91,14.22 LED109.A
  Bottom 0.406: 11.56,11.56 3.05,11.56 LED99.A | 11.56,11.56 16.51,11.56 | 16.51,11.56 21.46,11.56 | 21.46,11.56 26.42,11.56 | 26.42,11.56 31.37,11.56 | 31.37,11.56 36.32,11.56 | 36.32,11.56 41.27,11.56 | 41.27,11.56 48.77,11.56 | 48.77,11.56 51.18,11.56 | 51.18,11.56 58.67,11.56 | 58.67,11.56 61.09,11.56 | 61.09,11.56 67.18,11.56 LED112.K 67.18,14.35 61.09,14.35 | LED100.A 5.33,14.22 2.92,14.22 LED99.A | LED99.A 1.65,11.05 LED113.K 6.6,10.92 6.6,12.83 | 16.51,14.35 12.95,14.35 LED101.A 11.56,11.56 | 16.51,14.35 21.46,14.35 | 21.46,14.35 26.42,14.35 | 26.42,14.35 31.37,14.35 | 31.37,14.35 36.32,14.35 | 36.32,14.35 41.27,14.35 | 41.27,14.35 48.77,14.35 | 48.77,14.35 51.18,14.35 | 58.67,14.35 LED110.K | 51.18,11.56 LED109.A | LED109.A LED108.K | 41.27,11.56 LED107.A 41.27,14.35 | 36.32,11.56 LED106.A 36.32,14.35 | 31.37,11.56 LED105.A 31.37,14.35 | 26.42,11.56 LED104.A 26.42,14.35 | 21.46,11.56 LED103.A 21.46,14.35 | 16.51,11.56 LED102.A 16.51,14.35 | 48.77,11.56 48.77,14.35 | 51.18,14.35 LED109.A | 51.18,14.35 58.67,14.35 | 58.67,14.35 61.09,14.35 | 58.67,11.56 58.67,12.83 | 61.09,11.56 LED111.A | 61.09,14.35 LED111.A | LED110.K LED111.A | LED110.K 58.55,12.95
PIN7
  Top 0.406: LED3.K 12.83,42.8 12.83,39.62 | 12.83,26.29 12.83,23.11 LED73.K | 12.83,26.29 12.83,30.61 | 12.83,30.61 12.83,35.18 | 12.83,35.18 12.83,39.62 | LED17.K 12.83,39.62 | LED31.K 12.83,35.18 | LED45.K 12.95,30.73 12.83,30.61 | 12.83,26.29 13.97,26.29 | 13.97,26.29 LED59.K | LED73.K 14.1,19.81 LED88.A | LED73.K 14.1,19.94 LED87.A | LED73.K 15.24,22.99 15.24,35.18 | 15.24,35.18 15.24,39.62 | 15.24,39.62 15.24,42.93 LED3.K | LED17.K LED3.K | LED31.K LED17.K | LED31.K LED45.K | LED45.K 14.1,21.97 | 13.97,26.29 15.11,26.29 | LED45.K 15.11,30.73 | 15.24,35.18 LED31.K | 15.24,39.62 LED17.K | LED114.K 7.87,9.78 7.87,11.68 LED100.K | LED100.K 10.41,11.68 10.41,9.78 LED114.K | 00-07.8 47.5,49.66 47.5,18.67 LED94.K | LED100.K LED114.K
  Bottom 0.406: 16.51,16 3.05,16 LED85.A 2.92,18.67 10.29,18.67 LED87.A 11.56,15.37 LED100.K 6.6,15.49 LED86.A 6.6,18.54 | 16.51,16 21.46,16 | 21.46,16 26.29,16 | 26.29,16 31.37,16 | 31.37,16 36.32,16 | 36.32,16 41.4,16 | 41.4,16 48.77,16 | 48.77,16 51.31,16 | 51.31,16 58.67,16 | 58.67,16 61.21,16 | 61.21,16 67.18,16 LED98.K 67.18,18.8 61.09,18.8 | 21.46,18.8 17.91,18.8 LED88.A 16.51,16 | 21.46,18.8 26.42,18.8 | 26.42,18.8 31.37,18.8 | 31.37,18.8 36.32,18.8 | 36.32,18.8 41.27,18.8 | 48.77,18.8 41.27,18.8 | 48.77,18.8 51.18,18.8 | 51.18,18.8 58.67,18.8 | 58.67,18.8 61.09,18.8 | LED95.A LED94.K | LED95.A 51.18,16.13 51.31,16 | LED97.A LED96.K | LED97.A 61.09,16.13 61.21,16 | 21.46,16 LED89.A 21.46,18.8 | 26.29,16 26.42,16.13 LED90.A 26.42,18.8 | 31.37,16 LED91.A 31.37,18.8 | 36.32,16 LED92.A 36.32,18.8 | 41.27,17.27 41.27,16.13 41.4,16 | 41.27,17.27 LED93.A | 41.27,17.27 41.27,18.8 | 48.77,16 48.77,18.8 | 51.18,18.8 LED95.A | 58.67,16 58.67,18.8 | 61.09,18.8 LED97.A
PIN8
  Top 0.406: LED4.K 17.91,42.93 17.91,39.62 | 17.91,30.73 17.91,27.43 LED60.K | 17.91,30.73 17.91,35.31 | 17.91,35.31 17.91,39.62 | 19.05,24.64 19.05,24.26 LED75.A | 19.05,24.64 LED60.K | LED46.K 17.91,30.73 | LED32.K 17.91,35.18 17.91,35.31 | LED18.K 17.91,39.62 | LED4.K 20.19,42.93 20.19,39.62 | 20.19,35.18 20.19,39.62 | 20.19,30.73 20.19,27.43 LED60.K | 20.19,30.73 20.19,35.18 | LED60.K LED46.K | LED46.K LED32.K | LED32.K LED18.K | LED18.K LED4.K | LED18.K 20.19,39.62 | LED32.K 20.19,35.18 | LED74.A 19.05,24.38 19.05,24.64 | LED46.K 20.19,30.73 | 08-13.8 40.13,53.09 23.24,53.09 19.05,48.89 LED4.K | LED115.K 12.83,9.78 12.83,12.95 | 12.83,12.95 12.83,16.13 LED87.K | LED101.K 12.83,12.95 | LED87.K 15.24,16.26 15.24,12.95 | 15.24,12.95 15.24,9.65 LED115.K | LED115.K LED101.K | LED101.K LED87.K | LED101.K LED87.K | LED101.K 15.24,12.95
  Bottom 0.406: 6.6,20.45 3.05,20.45 LED71.A 2.92,23.11 6.6,23.11 | 21.46,20.45 6.6,20.45 | 21.46,20.45 26.42,20.45 | 26.42,20.45 31.37,20.45 | 31.37,20.45 36.32,20.45 | 36.32,20.45 41.15,20.45 | 60.96,20.45 67.18,20.45 LED84.K 67.18,23.24 61.09,23.24 | 58.8,20.45 60.96,20.45 | 51.18,20.45 58.8,20.45 | 48.77,20.45 51.18,20.45 | 41.15,20.45 48.77,20.45 | 26.42,23.24 22.86,23.24 LED75.A 21.46,20.45 | 26.42,23.24 31.37,23.24 | 31.37,23.24 36.32,23.24 | 36.32,23.24 41.27,23.24 | 41.27,23.24 48.77,23.24 | 48.77,23.24 58.67,23.24 | 58.67,23.24 61.09,23.24 | 6.6,23.11 15.24,23.11 LED74.A 16.51,19.81 LED87.K 11.56,19.94 LED73.A 11.56,22.99 | 6.6,20.45 LED72.A | 26.42,20.45 LED76.A 26.42,23.24 | 31.37,20.45 LED77.A 31.37,23.24 | 36.32,20.45 LED78.A 36.32,23.24 | 41.15,20.45 41.27,20.57 LED79.A 41.27,23.24 | 48.77,20.45 LED80.K | 51.18,20.45 LED81.A | LED82.K 58.67,20.57 58.8,20.45 | LED83.A 61.09,20.57 60.96,20.45 | 6.6,23.11 6.6,21.97 | 48.77,23.24 LED80.K | LED80.K LED81.A | LED81.A 51.18,22.99 | 58.67,23.24 LED82.K | LED82.K LED83.A | 61.09,23.24 LED83.A
PIN9
  Top 0.305: 08-13.7 39.62,51.31 38.48,52.45 23.75,52.45 22.61,51.31 22.61,45.47 LED5.K
  Top 0.406: LED5.K 22.73,42.8 22.73,39.62 | 22.73,35.31 22.73,32 LED47.K | 22.73,35.31 22.73,39.62 | LED47.K 24,28.7 LED62.A | LED33.K 22.86,35.18 22.73,35.31 | LED19.K 22.73,39.62 | LED5.K 25.15,42.93 25.15,39.62 | 25.15,35.18 25.15,39.62 | 25.15,35.18 25.15,31.88 LED47.K | LED47.K 24,28.83 LED61.A | LED47.K LED33.K | LED33.K LED19.K | LED19.K LED5.K | LED19.K 25.15,39.62 | LED33.K 25.15,35.18 | LED116.K 17.78,9.78 17.78,12.83 | 17.78,12.83 17.78,17.4 | 17.78,17.4 17.78,20.57 LED74.K | LED88.K 17.78,17.4 | LED102.K 17.91,12.95 17.78,12.83 | LED116.K 20.19,9.65 20.19,17.4 | 20.19,17.4 20.19,20.7 LED74.K | LED88.K LED74.K | LED102.K LED88.K | LED116.K LED102.K | LED102.K 20.07,12.95 | LED88.K 20.19,17.4
  Bottom 0.406: 6.73,24.89 3.05,24.89 LED57.A 3.05,27.69 6.6,27.69 | 6.73,24.89 11.68,24.89 | 26.42,24.89 11.68,24.89 | 26.42,24.89 31.37,24.89 | 31.37,24.89 36.2,24.89 | 36.2,24.89 41.27,24.89 | 41.27,24.89 48.9,24.89 | 48.9,24.89 58.67,24.89 | 58.67,24.89 61.09,24.89 | 61.09,24.89 67.18,24.89 LED70.K 67.18,27.69 61.09,27.69 | 6.6,27.69 20.07,27.69 LED61.A 21.46,24.26 LED74.K 16.51,24.38 LED60.A 16.51,27.56 | 11.68,24.89 11.56,25.02 LED59.A 11.56,27.56 | 6.73,24.89 6.6,25.02 LED58.A 6.6,27.69 | 31.37,27.69 27.81,27.69 LED62.A 26.42,24.89 | 31.37,27.69 36.32,27.69 | 36.32,27.69 41.27,27.69 | 41.27,27.69 48.77,27.69 | 48.77,27.69 51.18,27.69 | 51.18,27.69 58.67,27.69 | 58.67,27.69 61.09,27.69 | 31.37,27.69 LED63.A 31.37,24.89 | 36.2,24.89 36.32,25.02 LED64.A 36.32,27.69 | 41.27,24.89 LED65.A 41.27,27.69 | LED66.K 48.77,25.02 48.9,24.89 | 51.18,27.69 LED67.A | 58.67,27.69 LED68.K | 61.09,24.89 LED69.A | 48.77,27.69 LED66.K | LED66.K LED67.A | LED67.A 51.18,25.02 | 58.67,24.89 LED68.K | LED68.K LED69.A | LED69.A 61.09,27.69
PIN10
  Top 0.406: LED117.K 22.73,9.78 22.73,12.83 | 22.73,12.83 22.73,17.27 | 22.73,17.27 22.73,21.84 | 22.73,21.84 22.73,25.02 LED61.K | LED75.K 22.73,21.84 | LED89.K 22.86,17.4 22.73,17.27 | 23.88,12.95 22.86,12.95 22.73,12.83 | 23.88,12.95 LED103.K | LED117.K 25.15,9.65 25.15,12.95 | 25.15,17.4 25.15,12.95 | 25.15,17.4 25.15,25.15 LED61.K | LED75.K LED61.K | LED89.K LED75.K | LED117.K LED89.K | 25.15,12.95 23.88,12.95 | LED89.K 25.15,17.4 | LED75.K 25.02,21.84 | LED6.K 27.69,42.8 27.69,39.62 | 27.69,39.62 27.69,36.45 LED34.K | LED20.K 27.69,39.62 | LED34.K 28.96,33.15 LED49.A | LED6.K 30.1,42.93 30.1,39.62 | 30.1,39.62 30.1,36.32 LED34.K | LED34.K 28.96,33.27 LED48.A | LED20.K LED6.K | LED34.K LED20.K | LED34.K LED20.K | LED20.K 30.1,39.62 | 08-13.6 42.55,45.59 42.55,32 LED51.A
  Bottom 0.406: 6.6,29.34 3.05,29.34 LED43.A 2.92,32 16.51,32 | 11.56,29.34 6.6,29.34 | 16.64,29.34 11.56,29.34 | 31.37,29.34 36.32,29.34 | 31.37,29.34 16.64,29.34 | 36.32,29.34 41.27,29.34 | 41.27,29.34 48.77,29.34 | 48.77,29.34 58.8,29.34 | 58.8,29.34 67.18,29.34 LED56.K 67.18,32.13 61.09,32.13 | 21.46,32 25.15,32 LED48.A 26.42,28.7 LED61.K 21.46,28.83 LED47.A 21.46,32 | 21.46,32 16.51,32 | 16.64,29.34 16.51,29.46 LED46.A 16.51,32 | 11.56,29.34 LED45.A 11.56,31.88 | 6.6,29.34 LED44.A 6.6,31.88 | 36.32,32.13 32.77,32.13 LED49.A 31.37,29.34 | 36.32,32.13 41.27,32.13 | 41.27,32.13 51.05,32.13 | 51.05,32.13 58.67,32.13 | 58.67,32.13 61.09,32.13 | 61.09,32.13 LED55.A | LED54.K 58.67,29.46 58.8,29.34 | LED53.A 51.18,32 51.05,32.13 | 48.77,29.34 LED52.K | 41.27,32.13 LED51.A | 36.32,32.13 LED50.A | 36.32,29.34 36.32,32.13 | 41.27,29.34 41.27,30.61 | LED52.K 48.77,32 | LED53.A 51.18,29.46 | LED52.K LED53.A | 58.67,32.13 LED54.K | LED54.K LED55.A | LED55.A 61.09,29.46
PIN11
  Top 0.406: 08-13.5 33.91,50.42 LED7.K | LED21.K LED7.K | 33.91,39.5 LED21.K | 33.91,39.5 33.91,37.59 LED36.A | 33.91,39.5 33.91,37.72 LED35.A | LED118.K 27.69,9.78 27.69,12.95 | 27.69,26.16 27.69,29.46 LED48.K | 27.69,26.16 27.69,21.72 | 27.69,21.72 27.69,17.4 | 27.69,17.4 27.69,12.95 | LED62.K 27.81,26.29 27.69,26.16 | LED76.K 27.81,21.84 27.69,21.72 | LED90.K 27.69,17.4 | LED104.K 27.69,12.95 | LED118.K 30.1,9.65 30.1,12.95 | 30.1,17.4 30.1,12.95 | 30.1,21.84 30.1,17.4 | 30.1,21.84 30.1,29.59 LED48.K | LED48.K LED62.K | LED62.K LED76.K | LED76.K LED90.K | LED90.K LED104.K | LED104.K LED118.K | LED104.K 30.1,12.95 | 30.1,17.4 LED90.K | LED76.K 30.1,21.84 | LED62.K 29.97,26.29 | LED7.K 35.18,42.8 35.18,40.89 LED21.K
  Bottom 0.406: 6.73,36.45 2.92,36.45 LED29.A 3.05,33.78 6.6,33.78 | 6.73,36.45 11.56,36.45 | 11.56,36.45 16.64,36.45 | 16.64,36.45 21.59,36.45 | 21.59,36.45 26.42,36.45 | 26.42,36.45 30.1,36.45 LED35.A 31.37,33.15 LED48.K 26.42,33.27 26.42,35.05 | 6.6,33.78 11.56,33.78 | 11.56,33.78 16.51,33.78 | 16.51,33.78 21.46,33.78 | 21.46,33.78 36.32,33.78 | 36.32,33.78 41.27,33.78 | 41.27,33.78 48.77,33.78 | 48.77,33.78 51.18,33.78 | 51.18,33.78 58.67,33.78 | 58.67,33.78 61.09,33.78 | 61.09,33.78 67.18,33.78 LED42.K 67.18,36.58 61.09,36.58 | 26.42,36.45 LED34.A | 21.59,36.45 21.46,36.32 LED33.A 21.46,33.78 | LED32.A 16.51,36.32 16.64,36.45 | 11.56,36.45 LED31.A 11.56,33.78 | 6.73,36.45 6.6,36.32 LED30.A 6.6,33.78 | 58.67,36.58 61.09,36.58 | 51.18,36.58 58.67,36.58 | 48.77,36.58 51.18,36.58 | 41.27,36.58 48.77,36.58 | 41.27,36.58 37.72,36.58 LED36.A 36.32,33.78 | 41.27,36.58 LED37.A 41.27,33.78 | LED38.K 48.77,36.58 | LED39.A 51.18,36.58 | 58.67,36.58 LED40.K LED41.A | LED41.A 61.09,36.58 | 48.77,33.78 LED38.K | 51.18,33.78 LED39.A | 58.67,33.78 58.67,35.05 | 61.09,33.78 LED41.A | 16.51,33.78 16.51,35.05 | LED38.K LED39.A
PIN12
  Top 0.406: LED119.K 32.64,9.78 32.64,12.95 | 32.64,30.73 32.64,33.91 LED35.K | 32.64,30.73 32.64,26.04 | 32.64,26.04 32.64,21.97 | 32.64,12.95 32.64,17.4 | 32.64,17.4 32.64,21.97 | LED119.K 35.05,9.65 35.05,12.95 | 35.05,30.73 35.05,34.04 LED35.K | 35.05,30.73 35.05,26.29 | 35.05,26.29 35.05,21.84 | 35.05,12.95 35.05,21.84 | 32.64,30.73 LED49.K 35.05,30.73 | 32.64,26.04 32.64,26.29 LED63.K 35.05,26.29 | 32.64,21.97 32.64,21.84 LED77.K 35.05,21.84 | 32.64,17.4 LED91.K 34.92,17.4 | 32.64,12.95 LED105.K 35.05,12.95 | LED35.K LED119.K | 08-13.4 32.51,50.55 32.51,40.77 LED21.A | LED22.A 38.86,42.16 LED8.K 38.86,42.04 LED23.A
  Bottom 0.406: 48.77,41.02 42.67,41.02 LED23.A 41.27,38.23 | 48.77,41.02 51.18,41.02 | 51.18,41.02 58.67,41.02 | 58.67,41.02 61.09,41.02 | 61.09,41.02 67.18,41.02 LED28.K 67.18,38.23 61.09,38.23 | 48.77,41.02 LED24.K LED25.A 51.18,41.02 | 58.67,41.02 LED26.K LED27.A 61.09,41.02 | LED15.A 3.05,41.02 6.6,41.02 | 6.6,41.02 11.56,41.02 | 11.56,41.02 16.51,41.02 | 21.46,41.02 26.42,41.02 | 26.42,41.02 31.37,41.02 | 31.37,41.02 34.92,41.02 LED22.A | 31.37,41.02 LED21.A 31.37,37.72 LED35.K 36.32,37.59 36.32,39.5 | 26.42,41.02 LED20.A | 21.46,41.02 LED19.A 21.46,38.23 | 16.51,41.02 LED18.A 16.51,38.23 | 16.51,41.02 21.46,41.02 | 11.56,41.02 LED17.A 11.56,38.23 | 6.6,41.02 LED16.A 6.6,38.23 | 1.65,39.5 2.92,38.23 6.6,38.23 | 6.6,38.23 11.56,38.23 | 11.56,38.23 16.51,38.23 | 16.51,38.23 21.46,38.23 | 21.46,38.23 26.42,38.23 | 26.42,38.23 26.42,39.5 | 26.42,38.23 41.27,38.23 | 41.27,38.23 48.77,38.23 | 48.77,38.23 51.18,38.23 | 51.18,38.23 58.67,38.23 | 58.67,38.23 61.09,38.23 | 48.77,38.23 48.77,39.5 | 51.18,38.23 51.18,39.5 | 58.67,38.23 58.67,39.5 | 61.09,38.23 61.09,39.5
PIN13
  Top 0.406: LED120.K 37.59,9.78 37.59,12.83 | 37.59,17.27 37.59,12.83 | 37.59,21.84 37.59,17.27 | 37.59,21.84 37.59,26.42 | 37.59,29.34 37.59,26.42 | 37.59,29.34 37.59,29.46 | LED106.K 37.72,12.95 37.59,12.83 | LED92.K 37.72,17.4 37.59,17.27 | LED78.K 37.59,21.84 | LED64.K 37.72,26.29 37.59,26.42 | LED22.K LED36.K | LED36.K LED50.K | LED50.K LED64.K | LED64.K LED78.K | LED78.K LED92.K | LED92.K LED106.K | LED120.K LED106.K | LED120.K 40.01,9.65 40.01,17.27 | LED106.K 39.88,12.95 | 08-13.3 31.37,49.15 LED7.A | 29.46,50.93 26.42,47.88 LED6.A | LED92.K 39.88,17.4 40.01,17.27 | LED64.K 39.88,26.29 | LED78.K 39.88,21.84 | 40.01,35.18 40.01,38.48 LED22.K | 40.01,35.18 40.01,17.27 | LED50.K 39.88,30.73 | LED36.K 40.01,35.18 | 37.59,30.73 37.59,29.34 | 37.59,35.18 37.59,30.73 | 37.59,35.18 37.59,38.35 LED22.K | LED36.K 37.59,35.18 | LED50.K 37.59,30.73
  Bottom 0.406: 16.51,45.47 21.46,45.47 | 21.46,45.47 26.42,45.47 | 26.42,45.47 31.37,45.47 | 51.18,45.47 58.67,45.47 | 58.67,45.47 61.09,45.47 | 61.09,45.47 67.18,45.47 LED14.K | LED1.A 3.05,42.67 6.6,42.67 | 6.6,42.67 11.56,42.67 | 11.56,42.67 16.51,42.67 | 16.51,42.67 21.46,42.67 | 21.46,42.67 26.42,42.67 | 26.42,42.67 31.37,42.67 | 31.37,42.67 48.77,42.67 | 48.77,42.67 51.18,42.67 | 51.18,42.67 58.67,42.67 | 58.67,42.67 61.09,42.67 | 61.09,42.67 67.31,42.67 68.58,43.94 | 16.51,45.47 LED4.A 16.51,42.67 | 21.46,45.47 LED5.A 21.46,42.67 | 26.42,45.47 LED6.A 26.42,42.67 | 31.37,45.47 LED7.A | 36.32,45.47 LED8.A | 51.18,45.47 LED11.A LED10.K 48.77,42.67 | LED13.A 61.09,45.47 | LED12.K 58.67,45.47 | 6.6,42.67 LED2.A 8,45.47 11.56,45.47 | 11.56,42.67 LED3.A 11.56,45.47 | LED8.A 36.32,42.93 | 51.18,42.67 51.18,43.94 | 58.67,42.67 LED12.K | 61.09,42.67 LED13.A | LED12.K LED13.A | LED8.A 36.32,42.16 LED22.K 41.27,42.04 LED9.A 39.88,45.47 36.32,45.47 | 31.37,42.67 31.37,43.94 | 11.56,45.47 16.51,45.47 | 51.18,45.47 50.04,45.47 48.77,44.2 | 31.37,45.47 36.32,45.47
TOPFILL
  pour Top (isolate 0.305): 0,53.85 69.85,53.85 69.85,0 0,0

### Text on the board
tPlace: 13 | 12 | 11 | 10 | 9 | 8 | 7 | 6 | 5 | 4 | 3 | 2 | 1 | 0 | ARef | gnd | gnd | ARef | LoL Shield v1.5 | JimmiePRodgers.com/lolshield | A4 | A4 | 3v | RST | 5v | Vin | A5 | Gnd | A0 | A1 | A2 | A3 | A4 | A5 | A5
bPlace: jimmieprodgers.com/lolshield | make it play with you | or watch life blinking away | lots of leds
tValues: - | +
bDocu: v1.5